# EAGLE schematic Player_v0.3_simplified (EAGLE 6.2)

## Sheet 1 of 4: Player Board main
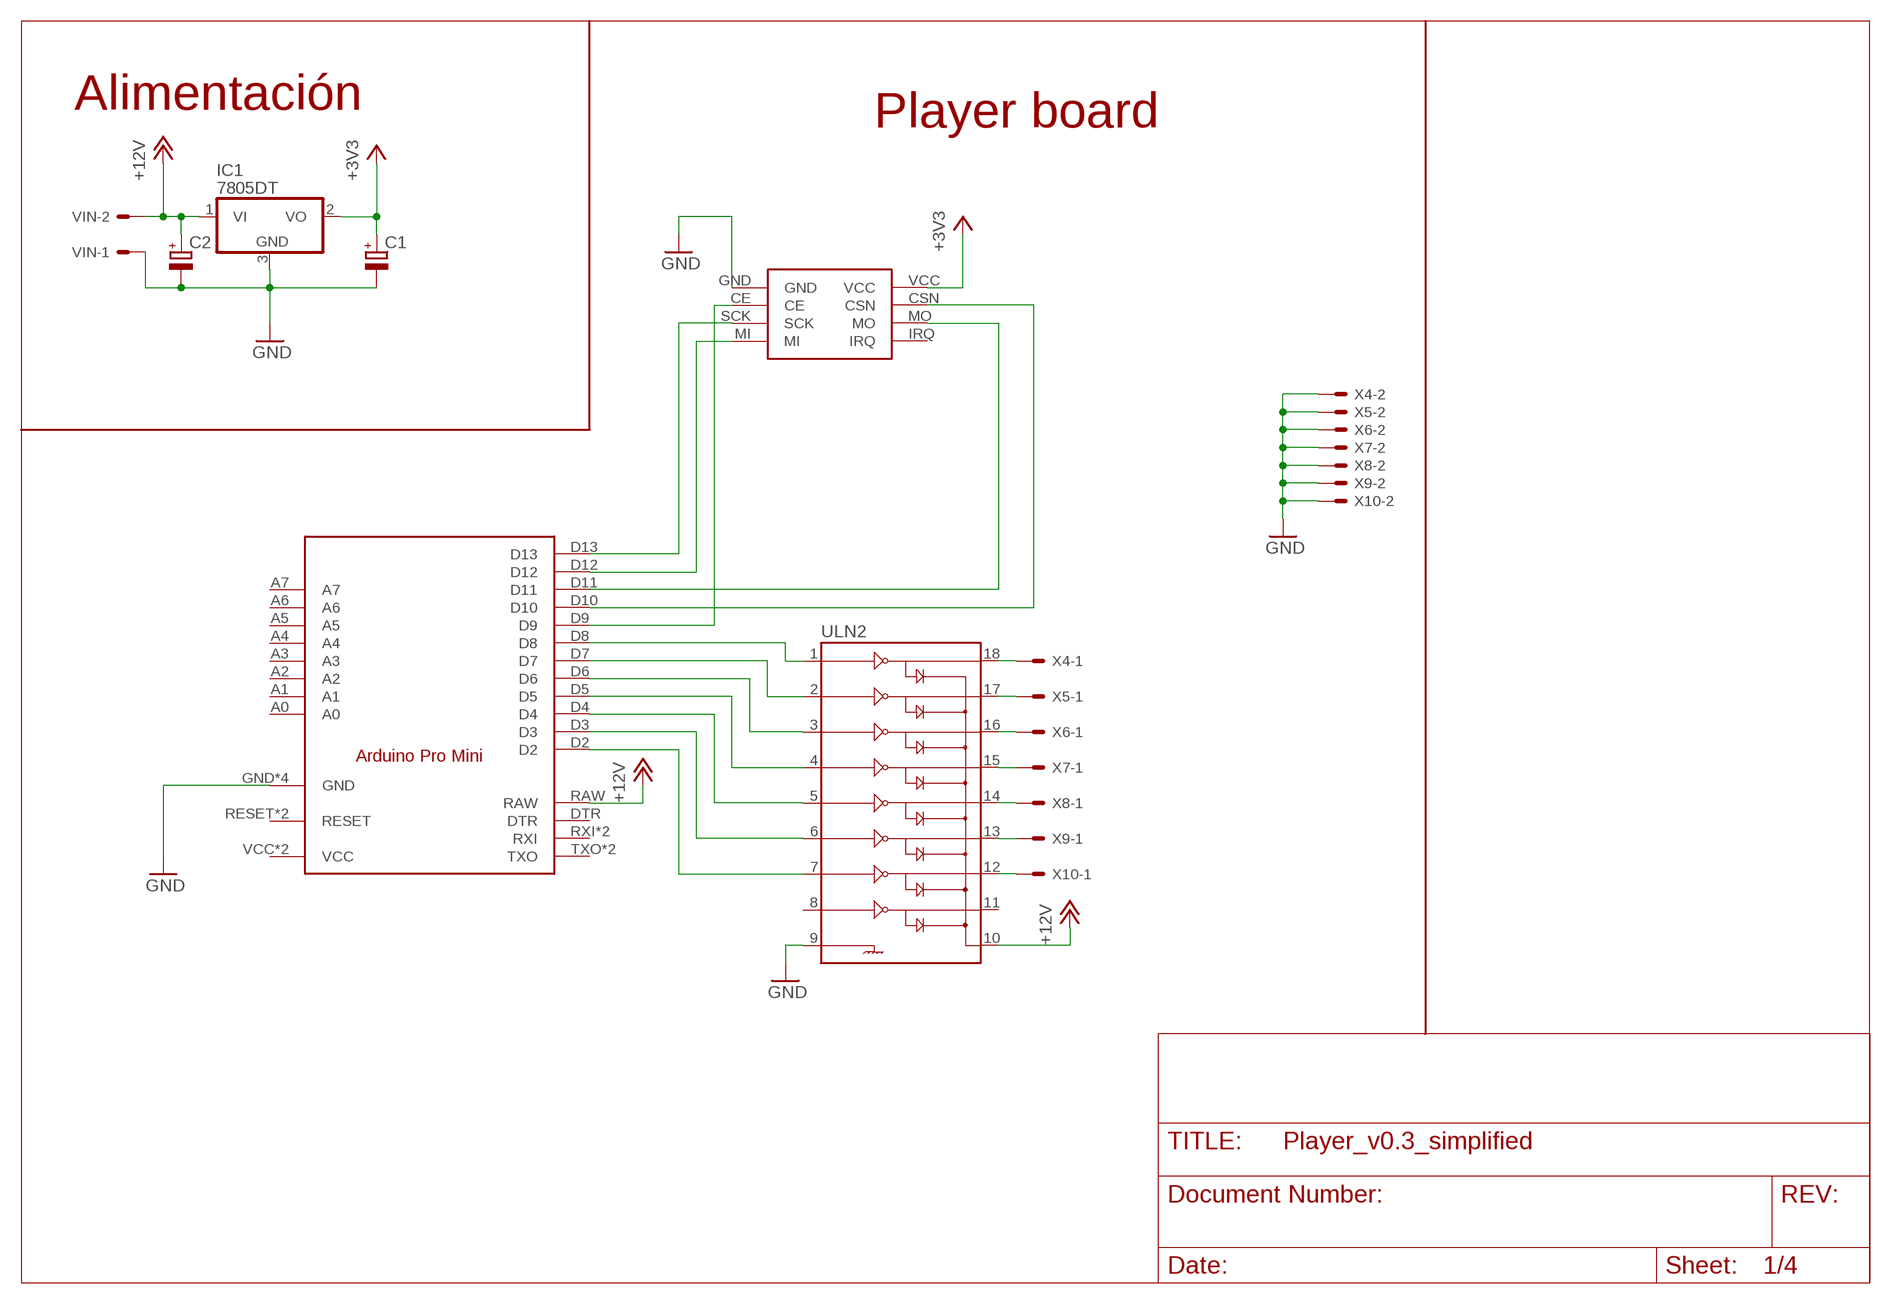
[diagram p0: schematic, sheet 1]

### Parts
C1  CPOL-EUE2.5-5  [E2,5-5]
C2  CPOL-EUE2.5-5  [E2,5-5]
IC1  7805DT  [TO252]
U$1  ARDUINO_PRO_MINI  [ARDUINO_PRO_MINI]
U$5  NRF24L01_8PIN  [NRF24L01_8PIN]
ULN2  ULN2803SOIC  [SO018]
VIN  KK-156-2  [KK-156-2]
X4  KK-156-2  [KK-156-2]
X5  KK-156-2  [KK-156-2]
X6  KK-156-2  [KK-156-2]
X7  KK-156-2  [KK-156-2]
X8  KK-156-2  [KK-156-2]
X9  KK-156-2  [KK-156-2]
X10  KK-156-2  [KK-156-2]

### Nets
+3V3: C1.+ IC1.2(VO) U$5.VCC ; also sheet 3
+12V: C2.+ IC1.1(VI) U$1.RAW ULN2.10 VIN.2 ; also sheet 2,3,4
GND: C1.- C2.- U$1.GND U$1.GND1(GND) U$1.GND2(GND) U$1.GND3(GND) U$5.GND ULN2.9 VIN.1 X4.2 X5.2 X6.2 X7.2 X8.2 X9.2 X10.2 ; also sheet 2,3,4
N$1: U$1.D7 ULN2.2
N$2: U$1.D3 ULN2.6
N$3: U$1.D5 ULN2.4
N$4: U$1.D6 ULN2.3
N$5: ULN2.18 X4.1
N$6: ULN2.17 X5.1
N$7: ULN2.16 X6.1
N$8: ULN2.15 X7.1
N$9: U$1.D12 U$5.MI
N$10: U$1.D11 U$5.MO
N$11: U$1.D13 U$5.SCK
N$12: U$1.D10 U$5.CSN
N$13: ULN2.14 X8.1
N$14: ULN2.13 X9.1
N$15: ULN2.12 X10.1
N$18: U$1.D9 U$5.CE
N$21: U$1.D2 ULN2.7
N$28: U$1.D8 ULN2.1
N$32: U$1.D4 ULN2.5
Unconnected: IC1.3(GND) U$1.A0 U$1.A1 U$1.A2 U$1.A3 U$1.A4 U$1.A5 U$1.A6 U$1.A7 U$1.DTR U$1.RESET U$1.RESET1(RESET) U$1.RXI U$1.RXI1(RXI) U$1.TXO U$1.TXO1(TXO) U$1.VCC U$1.VCC1(VCC) U$5.IRQ ULN2.8 ULN2.11

### Notes on the sheet
- Alimentación
- Player board

## Sheet 2 of 4
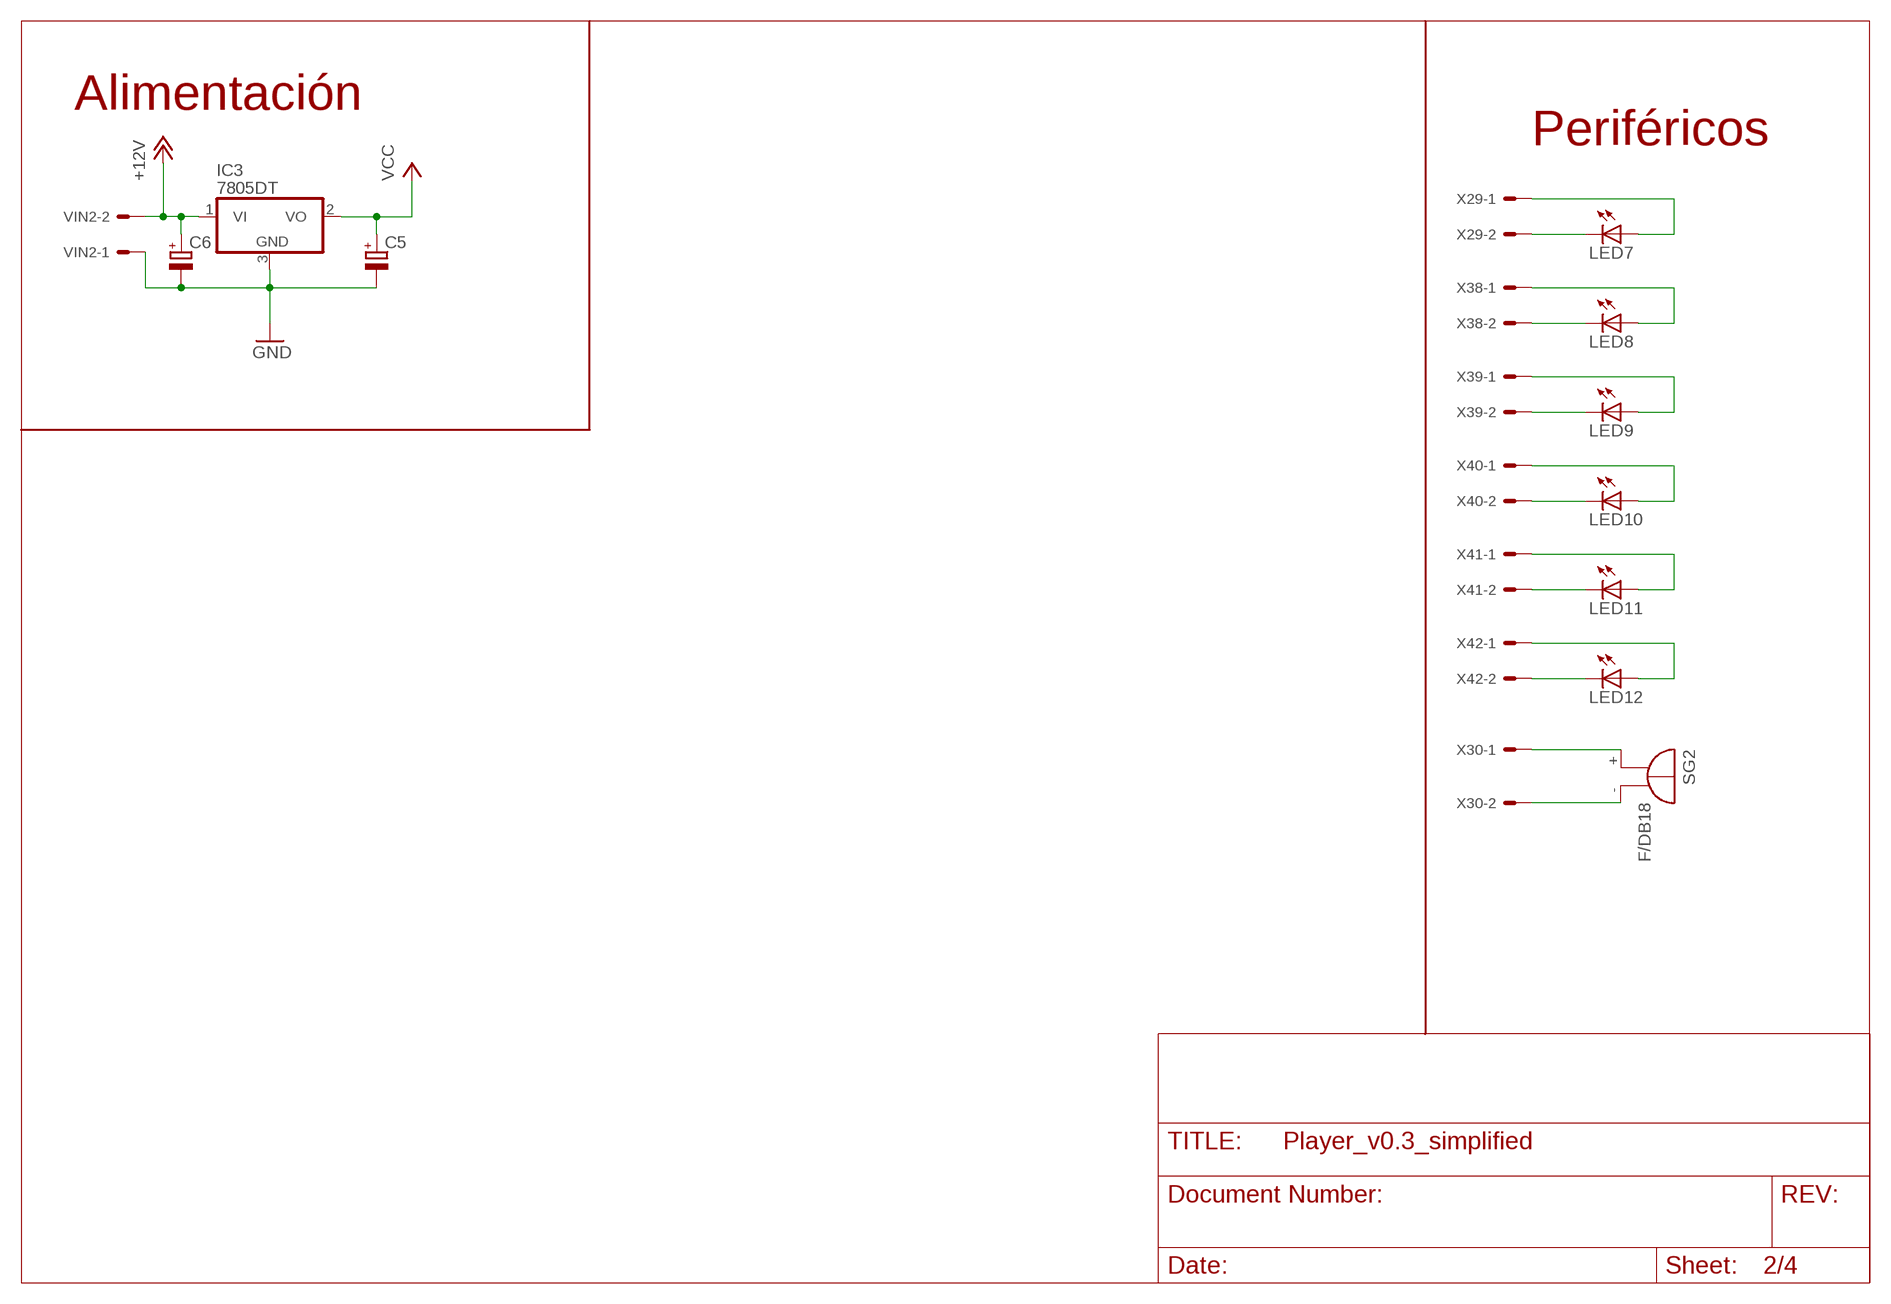
[diagram p1: schematic, sheet 2]

### Parts
C5  CPOL-EUE2.5-5  [E2,5-5]
C6  CPOL-EUE2.5-5  [E2,5-5]
IC3  7805DT  [TO252]
LED7  LED5MM  [LED5MM]
LED8  LED5MM  [LED5MM]
LED9  LED5MM  [LED5MM]
LED10  LED5MM  [LED5MM]
LED11  LED5MM  [LED5MM]
LED12  LED5MM  [LED5MM]
SG2  F/DB18  [F/DB18]
VIN2  KK-156-2  [KK-156-2]
X29  KK-156-2  [KK-156-2]
X30  KK-156-2  [KK-156-2]
X38  KK-156-2  [KK-156-2]
X39  KK-156-2  [KK-156-2]
X40  KK-156-2  [KK-156-2]
X41  KK-156-2  [KK-156-2]
X42  KK-156-2  [KK-156-2]

### Nets
+12V: C6.+ IC3.1(VI) VIN2.2 ; also sheet 1,3,4
GND: C5.- C6.- VIN2.1 ; also sheet 1,3,4
N$62: LED7.A X29.1
N$80: LED7.K(C) X29.2
N$81: LED8.A X38.1
N$82: LED8.K(C) X38.2
N$83: LED9.A X39.1
N$84: LED9.K(C) X39.2
N$85: LED10.A X40.1
N$86: LED10.K(C) X40.2
N$87: LED11.A X41.1
N$88: LED11.K(C) X41.2
N$89: LED12.A X42.1
N$90: LED12.K(C) X42.2
N$91: SG2.+ X30.1
N$92: SG2.- X30.2
VCC: C5.+ IC3.2(VO) ; also sheet 4
Unconnected: IC3.3(GND)

### Notes on the sheet
- Alimentación
- Periféricos

## Sheet 3 of 4: Control Board
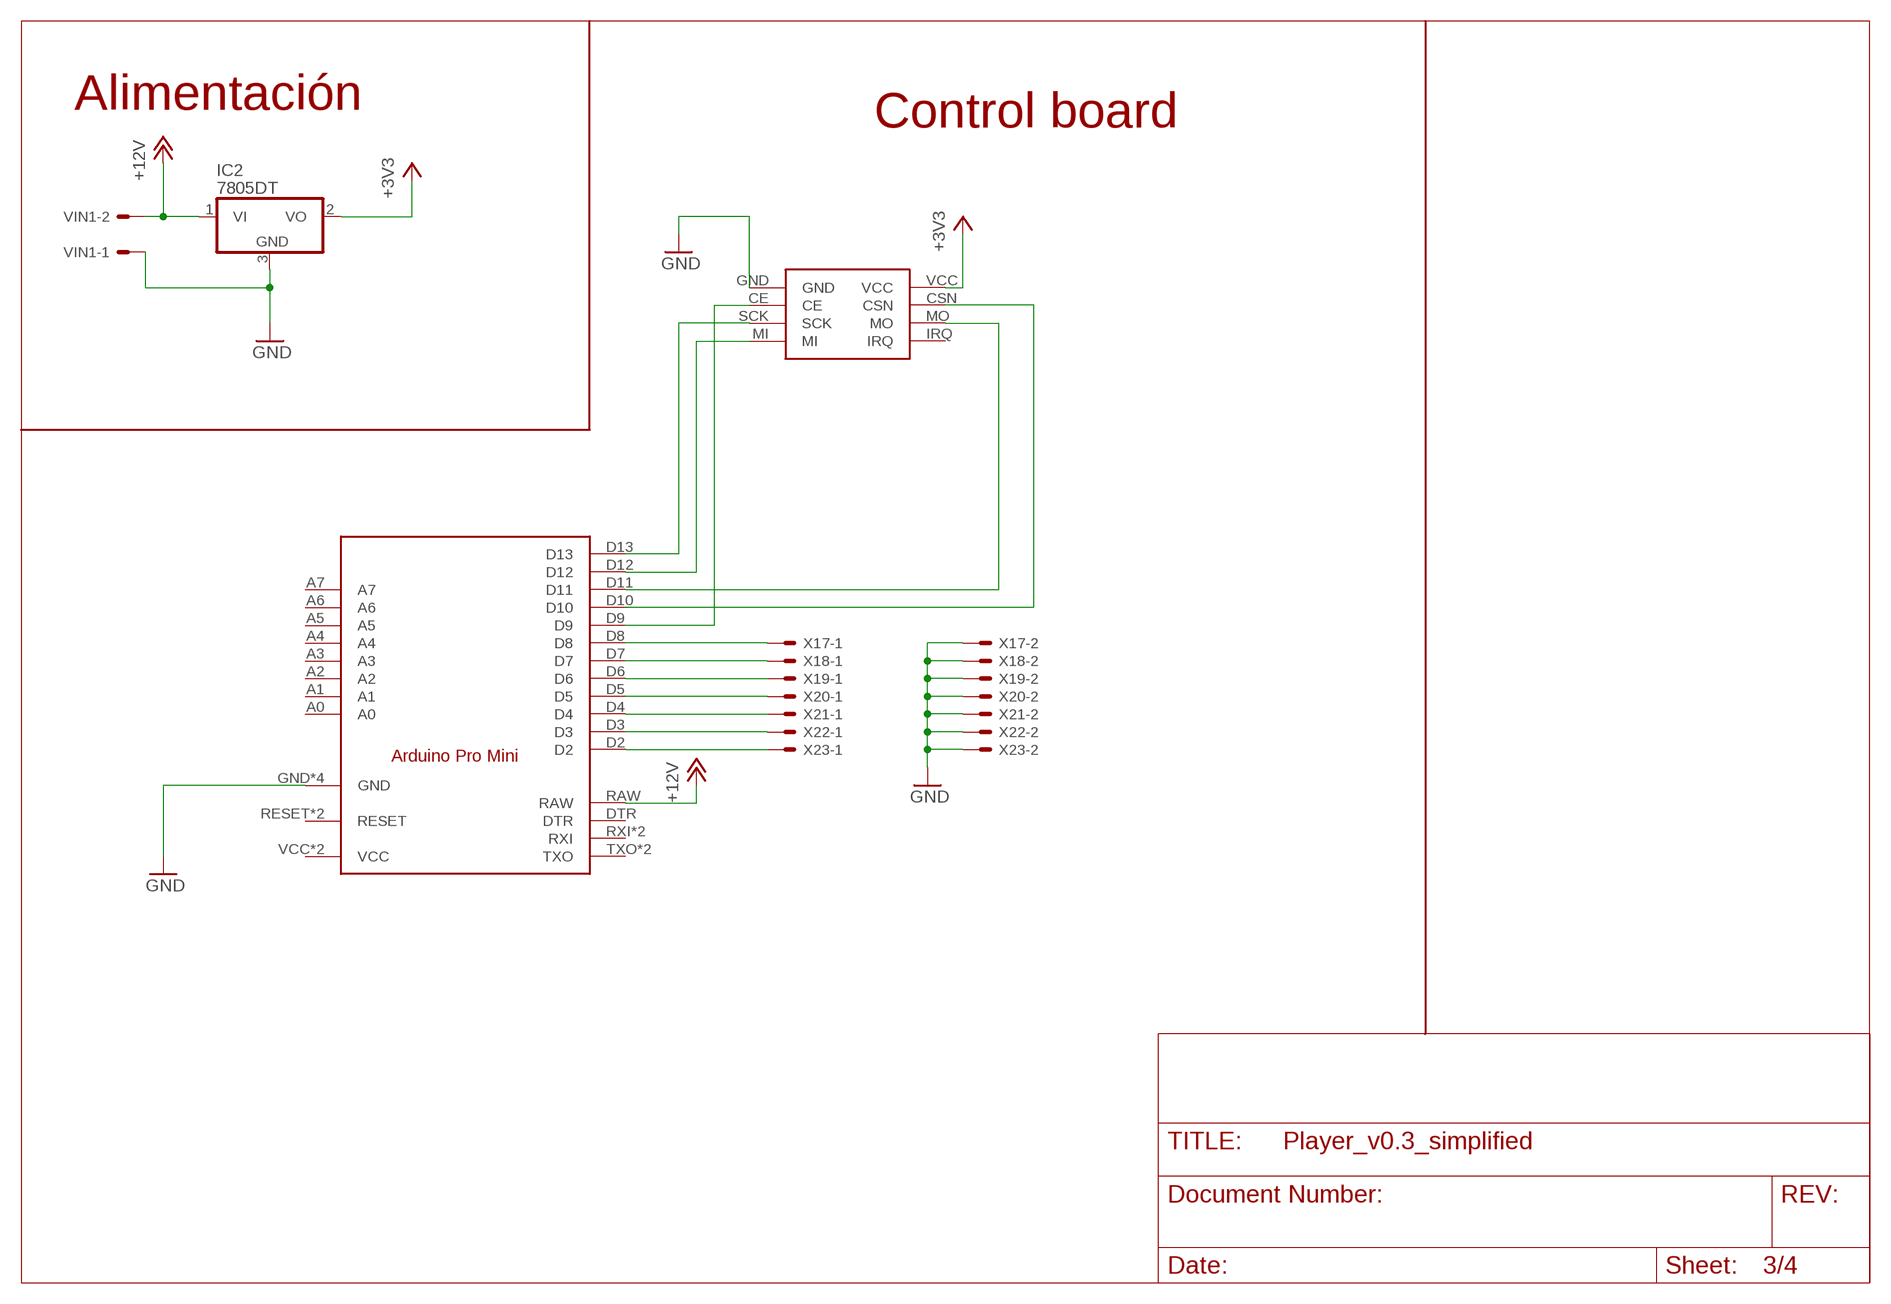
[diagram p2: schematic, sheet 3]

### Parts
IC2  7805DT  [TO252]
U$2  NRF24L01_8PIN  [NRF24L01_8PIN]
U$3  ARDUINO_PRO_MINI  [ARDUINO_PRO_MINI]
VIN1  KK-156-2  [KK-156-2]
X17  KK-156-2  [KK-156-2]
X18  KK-156-2  [KK-156-2]
X19  KK-156-2  [KK-156-2]
X20  KK-156-2  [KK-156-2]
X21  KK-156-2  [KK-156-2]
X22  KK-156-2  [KK-156-2]
X23  KK-156-2  [KK-156-2]

### Nets
+3V3: IC2.2(VO) U$2.VCC ; also sheet 1
+12V: IC2.1(VI) U$3.RAW VIN1.2 ; also sheet 1,2,4
GND: U$2.GND U$3.GND U$3.GND1(GND) U$3.GND2(GND) U$3.GND3(GND) VIN1.1 X17.2 X18.2 X19.2 X20.2 X21.2 X22.2 X23.2 ; also sheet 1,2,4
N$17: U$2.MI U$3.D12
N$19: U$2.MO U$3.D11
N$20: U$2.SCK U$3.D13
N$23: U$2.CSN U$3.D10
N$24: U$2.CE
N$39: U$3.D5 X20.1
N$40: U$3.D6 X19.1
N$41: U$3.D8 X17.1
N$42: U$3.D3 X22.1
N$43: U$3.D4 X21.1
N$44: U$3.D7 X18.1
N$45: U$3.D9
N$46: U$3.D2 X23.1
Unconnected: IC2.3(GND) U$2.IRQ U$3.A0 U$3.A1 U$3.A2 U$3.A3 U$3.A4 U$3.A5 U$3.A6 U$3.A7 U$3.DTR U$3.RESET U$3.RESET1(RESET) U$3.RXI U$3.RXI1(RXI) U$3.TXO U$3.TXO1(TXO) U$3.VCC U$3.VCC1(VCC)

### Notes on the sheet
- Alimentación
- Control board

## Sheet 4 of 4
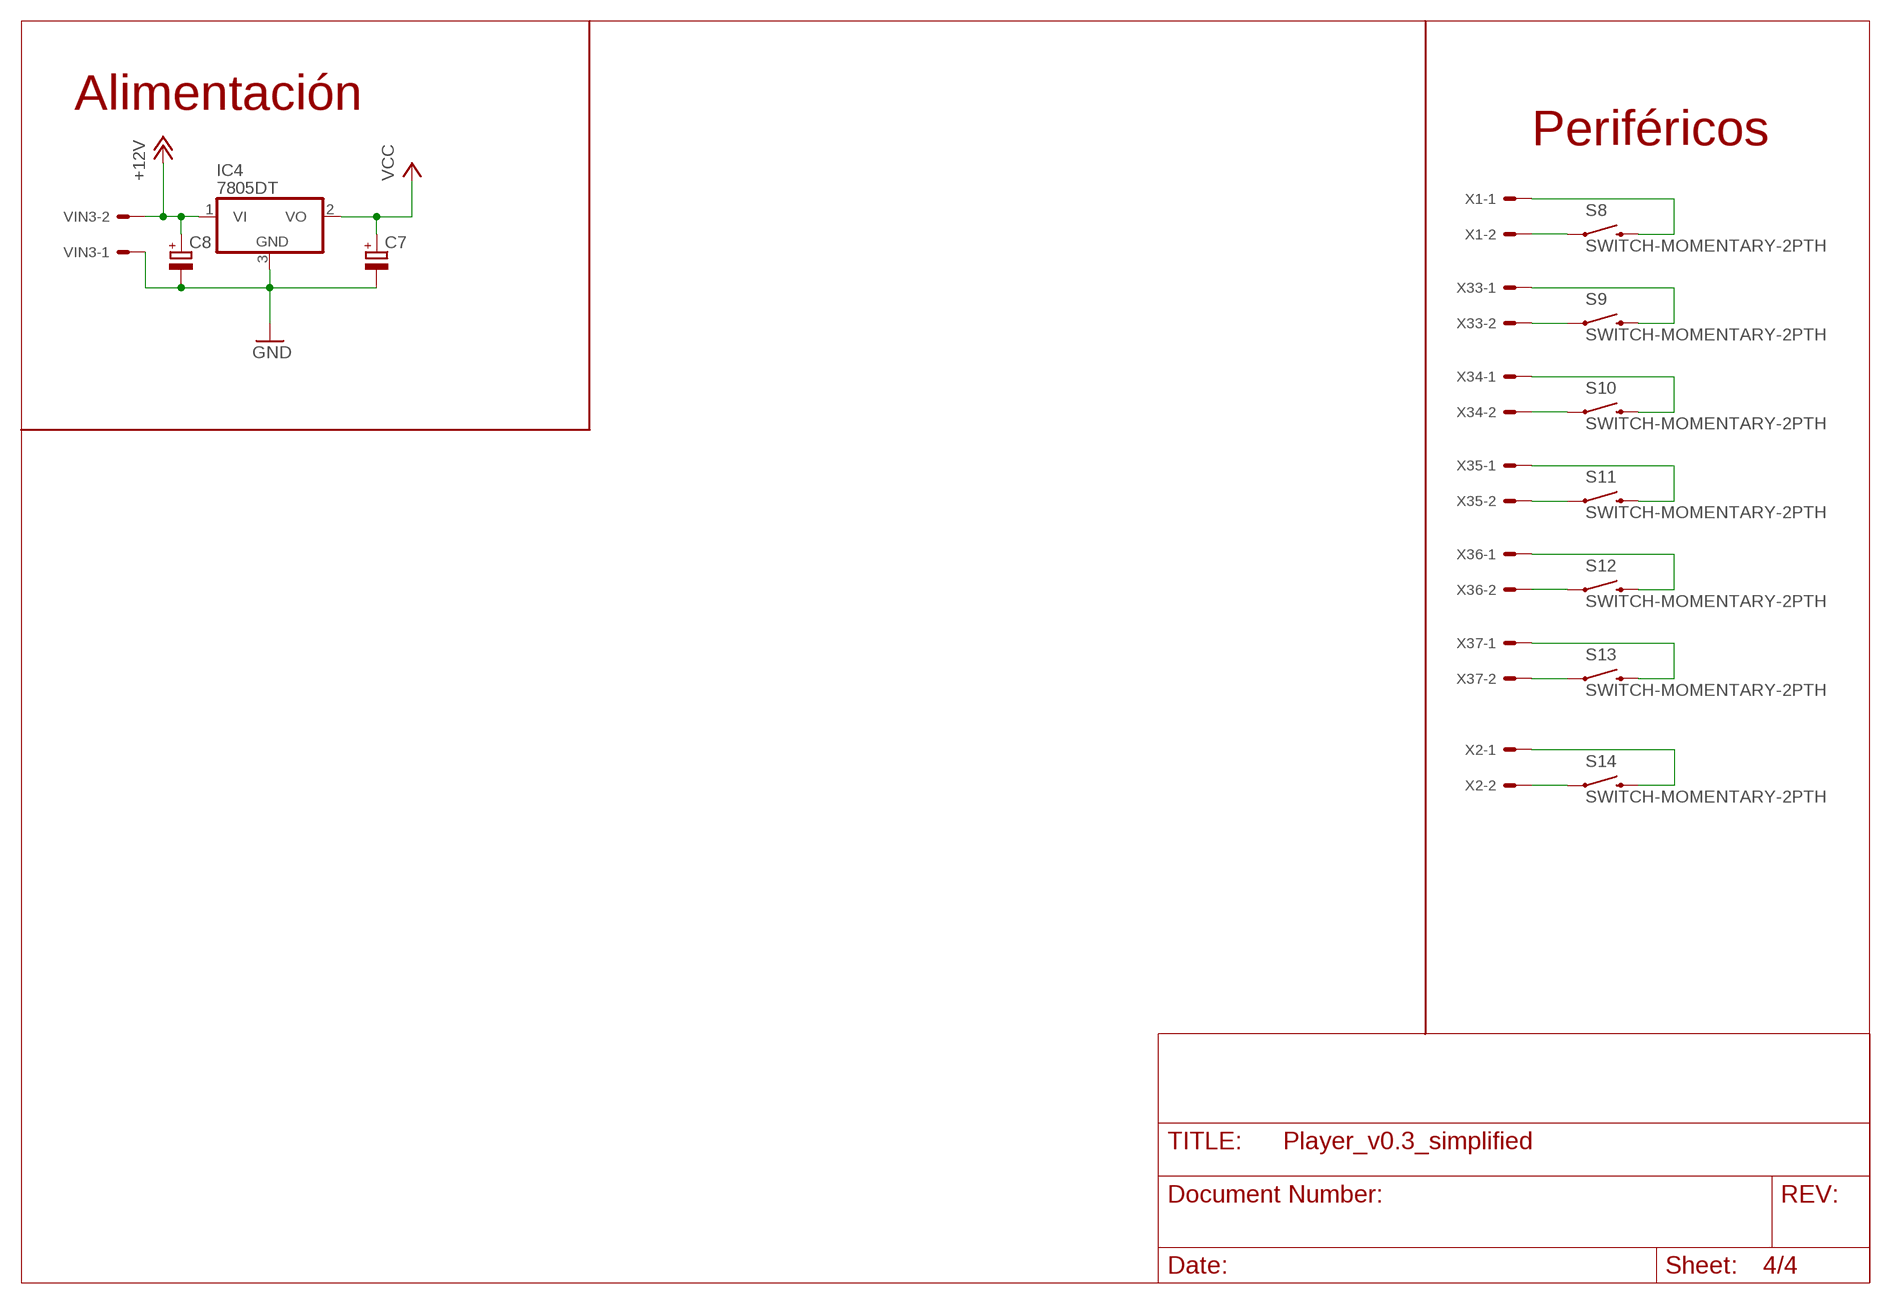
[diagram p3: schematic, sheet 4]

### Parts
C7  CPOL-EUE2.5-5  [E2,5-5]
C8  CPOL-EUE2.5-5  [E2,5-5]
IC4  7805DT  [TO252]
S8  SWITCH-MOMENTARY-2PTH  [TACTILE-PTH]
S9  SWITCH-MOMENTARY-2PTH  [TACTILE-PTH]
S10  SWITCH-MOMENTARY-2PTH  [TACTILE-PTH]
S11  SWITCH-MOMENTARY-2PTH  [TACTILE-PTH]
S12  SWITCH-MOMENTARY-2PTH  [TACTILE-PTH]
S13  SWITCH-MOMENTARY-2PTH  [TACTILE-PTH]
S14  SWITCH-MOMENTARY-2PTH  [TACTILE-PTH]
VIN3  KK-156-2  [KK-156-2]
X1  KK-156-2  [KK-156-2]
X2  KK-156-2  [KK-156-2]
X33  KK-156-2  [KK-156-2]
X34  KK-156-2  [KK-156-2]
X35  KK-156-2  [KK-156-2]
X36  KK-156-2  [KK-156-2]
X37  KK-156-2  [KK-156-2]

### Nets
+12V: C8.+ IC4.1(VI) VIN3.2 ; also sheet 1,2,3
GND: C7.- C8.- VIN3.1 ; also sheet 1,2,3
N$22: S8.3 X1.1
N$33: S9.3 X33.1
N$54: S10.3 X34.1
N$56: S11.3 X35.1
N$58: S12.3 X36.1
N$60: S13.3 X37.1
N$64: S14.3 X2.1
N$66: S14.1 X2.2
N$67: S13.1 X37.2
N$68: S12.1 X36.2
N$69: S11.1 X35.2
N$70: S10.1 X34.2
N$71: S9.1 X33.2
N$72: S8.1 X1.2
VCC: C7.+ IC4.2(VO) ; also sheet 2
Unconnected: IC4.3(GND)

### Notes on the sheet
- Alimentación
- Periféricos

## Library data of the parts
C1 C2 C5-C8 = rcl:CPOL-EU: POLARIZED CAPACITOR, European symbol
IC1-IC4 = linear:78*: Positive VOLTAGE REGULATOR Source: http://cache.national.com/ds/LM/LM78L05.pdf http://www.fairchildsemi.com/ds/LM/LM7805.pdf
LED7-LED12 = adafruit:LED: LED OSRAM: - CHIPLED LG R971, LG N971, LY N971, LG Q971, LY Q971, LO R971, LY R971 LH N974, LH R974 LS Q976, LO Q976, LY Q976 LO Q996 - Hyper CHIPLED LW Q18S LB Q993, LB Q99A, LB R99A - SideLED LS A670, LO A670, LY A670, LG A670, LP A670 LB A673, LV A673, LT A673, LW A673 LH A674 LY A675 LS A676, LA A676, LO A676, LY A676, LW A676 LS A679, LY A679, LG A679 - Hyper Micro SIDELED® LS Y876, LA Y876, LO Y876, LY Y876 LT Y87S - SmartLED LW L88C, LW L88S LB L89C, LB L89S, LG L890 LS L89K, LO L89K, LY L89K LS L896, LA L896, LO L896, LY L896 - TOPLED LS T670, LO T670, LY T670, LG T670, LP T670 LSG T670, LSP T670, LSY T670, LOP T670, LYG T670 LG T671, LOG T671, LSG T671 LB T673, LV T673, LT T673, LW T673 LH T674 LS T676, LA T676, LO T676, LY T676, LB T676, LH T676, LSB T676, LW T676 LB T67C, LV T67C, LT T67C, LS T67K, LO T67K, LY T67K, LW E67C LS E67B, LA E67B, LO E67B, LY E67B, LB E67C, LV E67C, LT E67C LW T67C LS T679, LY T679, LG T679 LS T770, LO T770, LY T770, LG T770, LP T770 LB T773, LV T773, LT T773, LW T773 LH T774 LS E675, LA E675, LY E675, LS T675 LS T776, LA T776, LO T776, LY T776, LB T776 LHGB T686 LT T68C, LB T68C - Hyper Mini TOPLED® LB M676 - Mini TOPLED Santana® LG M470 LS M47K, LO M47K, LY M47K Source: http://www.osram.convergy.de/
S8-S14 = SparkFun-Electromechanical:SWITCH-MOMENTARY-2: Various NO switches- pushbuttons, reed, etc
SG2 = buzzer:F/DB18: BUZZER Source: Buerklin; OC_FARNELL: unknown; OC_NEWARK: unknown
U$1 U$3 = MimaZ:ARDUINO_PRO_MINI: Arduino Pro Mini http://arduino.cc/en/Main/ArduinoBoardProMini
U$2 U$5 = nrf24l01_DealExtreme:NRF24L01_8PIN
ULN2 = SparkFun-PowerIC:ULN2803: Darlington Driver ULN2803 Darlington array. 500mA max per channel, 8-channel package. Spark Fun Electronics SKU : COM-00312
VIN VIN1-VIN3 X1 X2 X4-X10 X17-X23 X29 X30 X33-X42 = con-molex:KK-156-2: KK 156 HEADER Source: http://www.molex.com/pdm_docs/sd/026604100_sd.pdf; OC_FARNELL: unknown; OC_NEWARK: unknown